# Altium project sensor_boom.PrjPcb
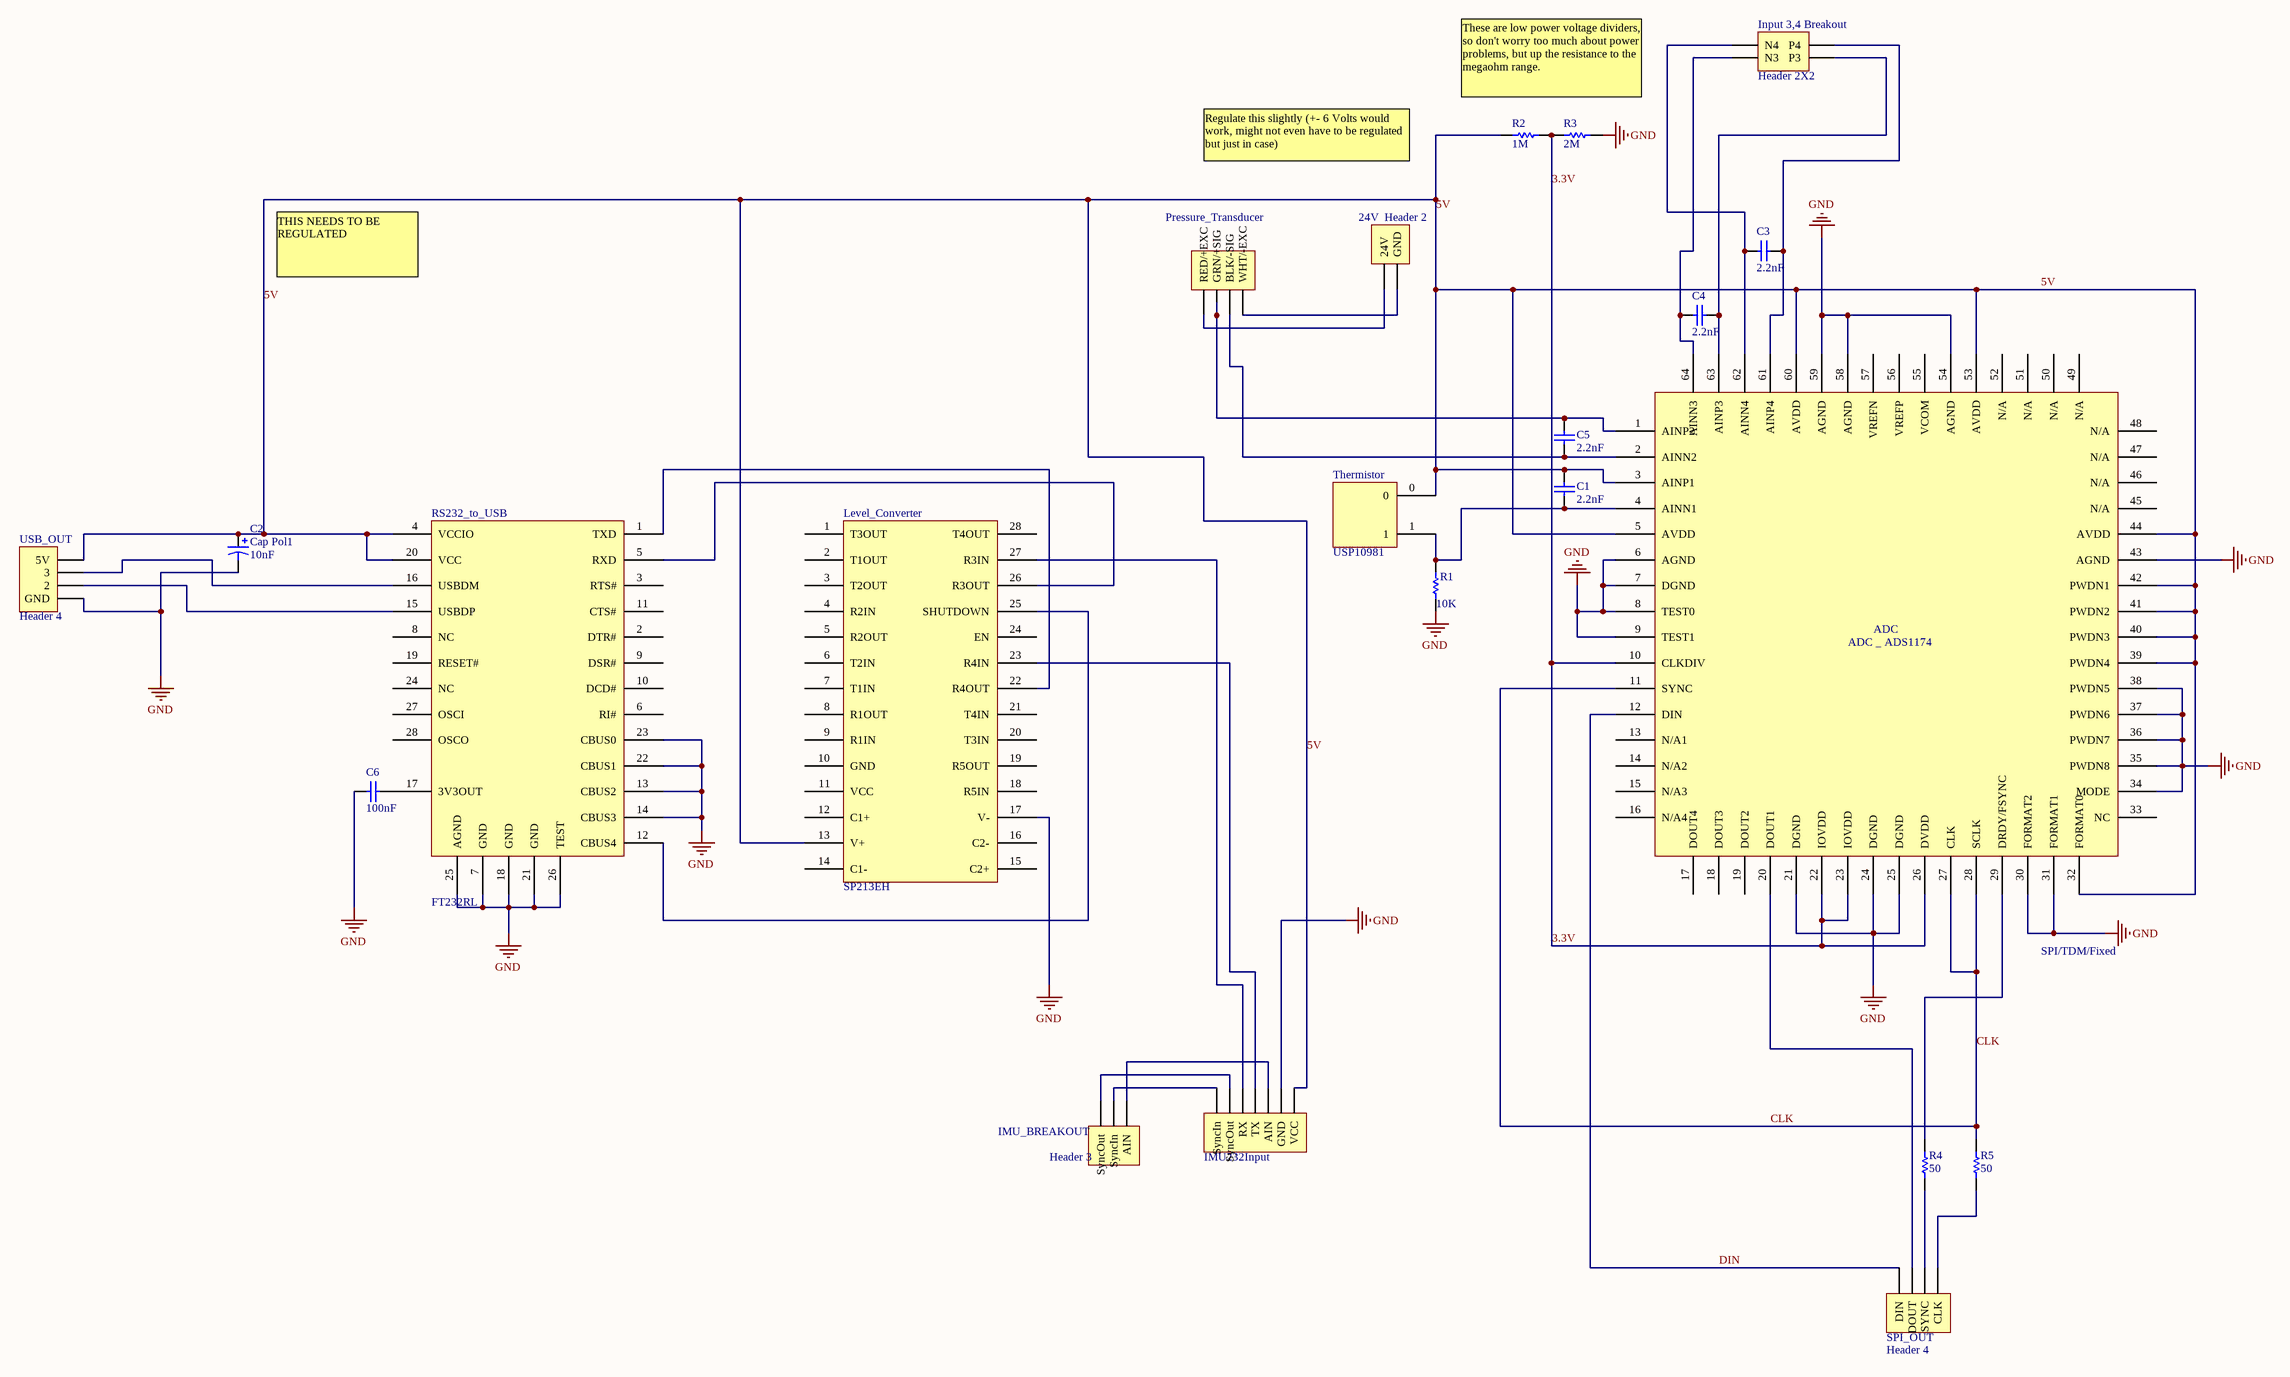
[diagram p0: sensor_boom.SchDoc]
1 sheet, 22 parts. Net scope: global (net labels, ports and power ports of the same name join across sheets).
Board file: sensor_boom.PcbDoc

## Sheet sensor_boom.SchDoc
size A2

### Parts
24V  Header 2  [HDR1X2]
ADC  ADC _ ADS1174  [ADC - ADS1174]
C1  value 2.2nF  [RAD-0.3]  (hidden comment: Cap)
C2  Cap Pol1  value 10nF  [RB7.6-15]
C3  value 2.2nF  [RAD-0.3]  (hidden comment: Cap)
C4  value 2.2nF  [RAD-0.3]  (hidden comment: Cap)
C5  value 2.2nF  [RAD-0.3]  (hidden comment: Cap)
C6  value 100nF  [RAD-0.3]  (hidden comment: Cap)
IMU232Input  Header 7  [HDR1X7]  (value not drawn)
IMU_BREAKOUT  Header 3  [HDR1X3]
Input_3,4_Breakout  Header 2X2  [HDR2X2]
Level_Converter  SP213EH  [SSOP-28(2)]
Pressure_Transducer  Header 4  [HDR1X4]  (value not drawn)
R1  value 10K  [AXIAL-0.3]  (hidden comment: Res1)
R2  value 1M  [AXIAL-0.3]  (hidden comment: Res1)
R3  value 2M  [AXIAL-0.3]  (hidden comment: Res1)
R4  value 50  [AXIAL-0.3]  (hidden comment: Res1)
R5  value 50  [AXIAL-0.3]  (hidden comment: Res1)
RS232_to_USB  FT232RL  [SSOP-28]
SPI_OUT  Header 4  [HDR1X4]
Thermistor  USP10981  [Thermistor]
USB_OUT  Header 4  [HDR1X4]

### Nets
GND: ADC.6(AGND) ADC.7(DGND) ADC.8(TEST0) ADC.9(TEST1) ADC.21(DGND) ADC.24(DGND) ADC.25(DGND) ADC.30(FORMAT2) ADC.31(FORMAT1) ADC.34(MODE) ADC.35(PWDN8) ADC.36(PWDN7) ADC.37(PWDN6) ADC.38(PWDN5) ADC.43(AGND) ADC.54(AGND) ADC.58(AGND) ADC.59(AGND) C2.2 C6.1 IMU232Input.6(GND) Level_Converter.17(V-) R1.1 R3.2 RS232_to_USB.7(GND) RS232_to_USB.13(CBUS2) RS232_to_USB.14(CBUS3) RS232_to_USB.18(GND) RS232_to_USB.21(GND) RS232_to_USB.22(CBUS1) RS232_to_USB.23(CBUS0) RS232_to_USB.25(AGND) RS232_to_USB.26(TEST) USB_OUT.1(GND)
3.3V: ADC.10(CLKDIV) ADC.22(IOVDD) ADC.23(IOVDD) ADC.26(DVDD) R2.2 R3.1
5V: ADC.3(AINP1) ADC.5(AVDD) ADC.32(FORMAT0) ADC.39(PWDN4) ADC.40(PWDN3) ADC.41(PWDN2) ADC.42(PWDN1) ADC.44(AVDD) ADC.53(AVDD) ADC.60(AVDD) C1.2 C2.1 IMU232Input.7(VCC) Level_Converter.13(V+) R2.1 RS232_to_USB.4(VCCIO) RS232_to_USB.20(VCC) Thermistor.0 USB_OUT.4(5V)
CLK: ADC.11(SYNC) ADC.27(CLK) ADC.28(SCLK) R5.2
DIN: ADC.12(DIN) SPI_OUT.4(DIN)
Net24V_1: 24V.1(24V) Pressure_Transducer.1(RED/+EXC)
Net24V_2: 24V.2(GND) Pressure_Transducer.4(WHT/-EXC)
NetADC_1: ADC.1(AINP2) C5.2 Pressure_Transducer.2(GRN/+SIG)
NetADC_2: ADC.2(AINN2) C5.1 Pressure_Transducer.3(BLK/-SIG)
NetADC_4: ADC.4(AINN1) C1.1 R1.2 Thermistor.1
NetADC_20: ADC.20(DOUT1) SPI_OUT.3(DOUT)
NetADC_29: ADC.29(DRDY/FSYNC) R4.2
NetADC_61: ADC.61(AINP4) C3.1 Input_3,4_Breakout.3(P4)
NetADC_62: ADC.62(AINN4) C3.2 Input_3,4_Breakout.4(N4)
NetADC_63: ADC.63(AINP3) C4.1 Input_3,4_Breakout.1(P3)
NetADC_64: ADC.64(AINN3) C4.2 Input_3,4_Breakout.2(N3)
NetC6_2: C6.2 RS232_to_USB.17(3V3OUT)
NetIMU232Input_1: IMU232Input.1(SyncIn) IMU_BREAKOUT.2(SyncIn)
NetIMU232Input_2: IMU232Input.2(SyncOut) IMU_BREAKOUT.3(SyncOut)
NetIMU232Input_3: IMU232Input.3(RX) Level_Converter.27(R3IN)
NetIMU232Input_4: IMU232Input.4(TX) Level_Converter.23(R4IN)
NetIMU232Input_5: IMU232Input.5(AIN) IMU_BREAKOUT.1(AIN)
NetLevel_Converter_22: Level_Converter.22(R4OUT) RS232_to_USB.1(TXD)
NetLevel_Converter_25: Level_Converter.25(SHUTDOWN) RS232_to_USB.12(CBUS4)
NetLevel_Converter_26: Level_Converter.26(R3OUT) RS232_to_USB.5(RXD)
NetR4_1: R4.1 SPI_OUT.2(SYNC)
NetR5_1: R5.1 SPI_OUT.1(CLK)
NetRS232_to_USB_15: RS232_to_USB.15(USBDP) USB_OUT.2
NetRS232_to_USB_16: RS232_to_USB.16(USBDM) USB_OUT.3

Not connected (* = marked no-connect by the designer): ADC 13(N/A1) 14(N/A2) 15(N/A3) 16(N/A4) 17(DOUT4) 18(DOUT3) 19(DOUT2) 33(NC) 45(N/A) 46(N/A) 47(N/A) 48(N/A) 49(N/A) 50(N/A) 51(N/A) 52(N/A) 55(VCOM) 56(VREFP) 57(VREFN); Level_Converter 1(T3OUT) 2(T1OUT) 3(T2OUT) 4(R2IN) 5(R2OUT) 6(T2IN) 7(T1IN) 8(R1OUT) 9(R1IN) 10(GND) 11(VCC) 12(C1+) 14(C1-) 15(C2+) 16(C2-) 18(R5IN) 19(R5OUT) 20(T3IN) 21(T4IN) 24(EN) 28(T4OUT); RS232_to_USB 2(DTR#) 3(RTS#) 6(RI#) 8(NC) 9(DSR#) 10(DCD#) 11(CTS#) 19(RESET#) 24(NC) 27(OSCI) 28(OSCO)

### Notes on the sheet
- These are low power voltage dividers, so don't worry too much about power problems, but up the resistance to the megaohm range.
- Regulate this slightly (+- 6 Volts would work, might not even have to be regulated but just in case)
- THIS NEEDS TO BE REGULATED
- SPI/TDM/Fixed

### Library data of the parts
24V = Header 2: Header, 2-Pin; LatestRevisionDate: 17-Jul-2002; LatestRevisionNote: Re-released for DXP Platform.; Publisher: Altium Limited
C1 C3-C6 = Cap: Capacitor; Published: 8-Jun-2000; LatestRevisionDate: 17-Jul-2002; LatestRevisionNote: Re-released for DXP Platform.; PackageReference: RAD-0.3; Publisher: Altium Limited; PackageDescription: Radial Cap, Thru-Hole; 2 Leads; 0.3 in Pin Spacing
C2 = Cap Pol1: Polarized Capacitor (Radial); Published: 8-Jun-2000; LatestRevisionDate: 17-Jul-2002; LatestRevisionNote: Re-released for DXP Platform.; PackageReference: RB7.6-15; Publisher: Altium Limited; PackageDescription: Polarized Capacitor (Radial); 2 Leads
IMU232Input = Header 7: Header, 7-Pin; LatestRevisionDate: 17-Jul-2002; LatestRevisionNote: Re-released for DXP Platform.; Publisher: Altium Limited
IMU_BREAKOUT = Header 3: Header, 3-Pin; LatestRevisionDate: 17-Jul-2002; LatestRevisionNote: Re-released for DXP Platform.; Publisher: Altium Limited
Input_3,4_Breakout = Header 2X2: Header, 2-Pin, Dual row; LatestRevisionDate: 17-Jul-2002; LatestRevisionNote: Re-released for DXP Platform.; Publisher: Altium Limited
Pressure_Transducer SPI_OUT USB_OUT = Header 4: Header, 4-Pin; LatestRevisionDate: 17-Jul-2002; LatestRevisionNote: Re-released for DXP Platform.; Publisher: Altium Limited
R1-R5 = Res1: Resistor; Published: 8-Jun-2000; LatestRevisionDate: 17-Jul-2002; LatestRevisionNote: Re-released for DXP Platform.; PackageReference: AXIAL-0.3; Publisher: Altium Limited; PackageDescription: Axial Device, Thru-Hole; 2 Leads; 0.3 in Pin Spacing